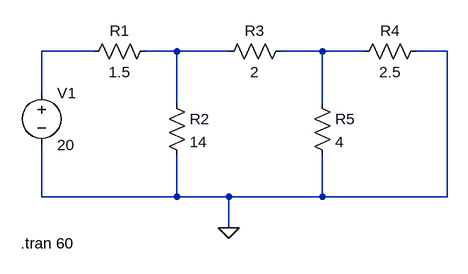
[diagram p0: schematic first_basic_circuit.asc]
first_basic_circuit.asc, the LTspice schematic file:
Version 4.1
SHEET 1 880 680
WIRE 112 -96 32 -96
WIRE 240 -96 192 -96
WIRE 320 -96 240 -96
WIRE 464 -96 400 -96
WIRE 528 -96 464 -96
WIRE 656 -96 608 -96
WIRE 32 -32 32 -96
WIRE 240 -16 240 -96
WIRE 464 -16 464 -96
WIRE 32 128 32 48
WIRE 240 128 240 64
WIRE 240 128 32 128
WIRE 320 128 240 128
WIRE 464 128 464 64
WIRE 464 128 320 128
WIRE 656 128 656 -96
WIRE 656 128 464 128
WIRE 320 176 320 128
FLAG 320 176 0
SYMBOL res 208 -112 R90
WINDOW 0 0 56 VBottom 2
WINDOW 3 32 56 VTop 2
SYMATTR InstName R1
SYMATTR Value 1.5
SYMBOL res 224 -32 R0
SYMATTR InstName R2
SYMATTR Value 14
SYMBOL res 416 -112 R90
WINDOW 0 0 56 VBottom 2
WINDOW 3 32 56 VTop 2
SYMATTR InstName R3
SYMATTR Value 2
SYMBOL res 624 -112 R90
WINDOW 0 0 56 VBottom 2
WINDOW 3 32 56 VTop 2
SYMATTR InstName R4
SYMATTR Value 2.5
SYMBOL res 448 -32 R0
SYMATTR InstName R5
SYMATTR Value 4
SYMBOL voltage 32 -48 R0
WINDOW 123 0 0 Left 0
WINDOW 39 0 0 Left 0
SYMATTR InstName V1
SYMATTR Value 20
TEXT 0 200 Left 2 !.tran 60

The netlist it stands for:
* first_basic_circuit.asc
R1 N002 N001 1.5
R2 N002 0 14
R3 N003 N002 2
R4 0 N003 2.5
R5 N003 0 4
V1 N001 0 20
.tran 60
.backanno
.end